# Altium schematic sheet Sheet1.SchDoc
size A; SheetNumber: 1; SheetTotal: 4
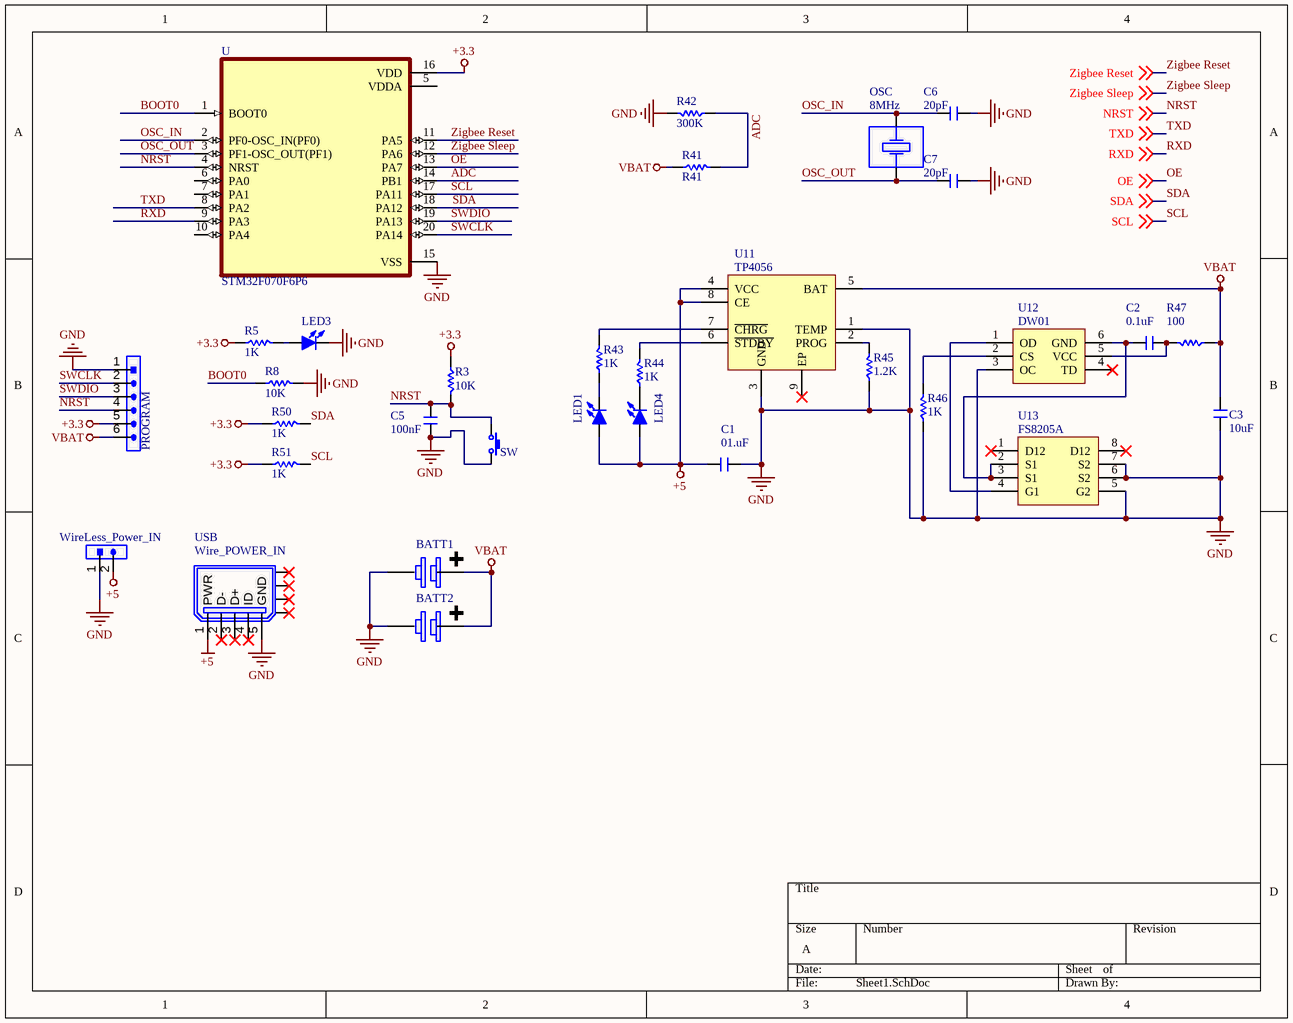
[diagram p0: Sheet1.SchDoc]

## Parts
BATT1  Battery 1850  [18650 SINGLE 2]  (value not drawn)
BATT2  Battery 1850  [18650 SINGLE 2]  (value not drawn)
C1  01.uF  [C 0402]
C2  0.1uF  [C 0402]
C3  10uF  [C 0603]
C5  100nF  [C 0805]
C6  20pF  [C 0805]
C7  20pF  [C 0805]
LED1  LED-SMD  [LED 0805R]  (value not drawn)
LED3  LED-SMD  [LED 0805R]  (value not drawn)
LED4  LED-SMD  [LED 0805G]  (value not drawn)
OSC  8MHz  [XTAL-HC49S-THD]
PROGRAM  HDR-1X6  [HDR-1X6]  (value not drawn)
R3  10K  [R 0805]
R5  1K  [R 0805]
R8  10K  [R 0805]
R41  R41  [R 0805]
R42  300K  [R 0805]
R43  1K  [R 0402]
R44  1K  [R 0402]
R45  1.2K  [R 0402]
R46  1K  [R 0402]
R47  100  [R 0402]
R50  1K  [R 0805]
R51  1K  [R 0805]
SW  3x6x5  [TSW SMD-3*6*2.5]  (value not drawn)
U  STM32F070F6P6  [SOP65P640X120-20N]
U11  TP4056  [SOP8_M-EP]
U12  DW01  [SOT23-6M]
U13  FS8205A  [SSOP8_L]
USB  Wire_POWER_IN  [USB-micro_B]
WireLess_Power_IN  HDR-1X2  [XH2.54-2P]  (value not drawn)

## Nets
+3.3: PROGRAM.5 R3.1 R5.1 R50.1 R51.1 U.16(VDD)
+5: C1.2 LED1.1(A) LED4.1(A) U11.4(VCC) U11.8(CE) USB.1(PWR) WireLess_Power_IN.2
GND: BATT1.2(-) BATT2.2(-) C1.1 C3.1 C5.1 C6.1 C7.1 LED3.2(K) PROGRAM.1 R8.2 R42.2 R45.1 R46.1 SW.2 U.15(VSS) U11.1(TEMP) U11.3(GND) U12.3(OC) U13.5(G2) U13.6(S2) U13.7(S2) USB.5(SHIELD) WireLess_Power_IN.1
VBAT: BATT1.1(+) BATT2.1(+) C3.2 PROGRAM.6 R41.1 R47.1 U11.5(BAT)
ADC: R41.2 R42.1 U.14(PB1)
BOOT0: R8.1 U.1(BOOT0)
NRST: C5.2 PROGRAM.4 R3.2 SW.1 U.4(NRST) ; off-sheet NRST
OE: U.13(PA7) ; off-sheet OE
OSC_IN: C6.2 OSC.2 U.2(PF0-OSC_IN(PF0))
OSC_OUT: C7.2 OSC.1 U.3(PF1-OSC_OUT(PF1))
RXD: U.9(PA3) ; off-sheet RXD
SCL: R51.2 U.17(PA11) ; off-sheet SCL
SDA: R50.2 U.18(PA12) ; off-sheet SDA
SWCLK: PROGRAM.2 U.20(PA14)
SWDIO: PROGRAM.3 U.19(PA13)
TXD: U.8(PA2) ; off-sheet TXD
Zigbee Reset: U.11(PA5) ; off-sheet Zigbee Reset
Zigbee Sleep: U.12(PA6) ; off-sheet Zigbee Sleep
NetC2_1: C2.1 U12.6(GND) U13.2(S1) U13.3(S1)
NetC2_2: C2.2 R47.2 U12.5(VCC)
NetLED1_2: LED1.2(K) R43.1
NetLED3_1: LED3.1(A) R5.2
NetLED4_2: LED4.2(K) R44.1
NetR43_2: R43.2 U11.7(~{CHRG})
NetR44_2: R44.2 U11.6(~{STDBY})
NetR45_2: R45.2 U11.2(PROG)
NetR46_2: R46.2 U12.2(CS)
NetU12_1: U12.1(OD) U13.4(G1)

Not connected (* = marked no-connect by the designer): U 5(VDDA) 6(PA0) 7(PA1) 10(PA4); U11 9(EP)*; U12 4(TD)*; U13 1(D12)* 8(D12)*; USB 2(D-)* 3(D+)* 4(ID)*

## Library data of the parts
C1-C3 C5-C7 = C: Non-polar patch capacitor; BOM名称: 无极性贴片电容; 版权归属: 源创客; 学习资源: www.ooocke.com
LED1 LED3 LED4 = LED-SMD: Patch LED; BOM名称: 贴片LED; 版权归属: 源创客; 学习资源: www.ooocke.com
OSC = XTAL-2: 2-Pin crystal; BOM名称: 2脚晶振; 版权归属: 源创客; 学习资源: www.ooocke.com
PROGRAM = Header 6: 6P Connector; BOM名称: 6P接插件; 版权归属: 源创客; 学习资源: www.ooocke.com
R3 R5 R8 R41-R47 R50 R51 = R: Chip resistor; 版权归属: 源创客; BOM名称: Chip resistor; 学习资源: www.ooocke.com
SW = TSW 3x6: 3x6 tact switch; BOM名称: 3x6轻触开关; 版权归属: 源创客; 学习资源: www.ooocke.com
U = STM32F070F6P6: ARMÂ® CortexÂ®-M0 STM32F0 Microcontroller IC 32-Bit 48MHz 32KB _32K x 8_ FLASH 20-TSSOP; MF: STMicroelectronics; SnapEDA_Link: https://www.snapeda.com/parts/STM32F070F6P6/STMicroelectronics/view-part/423630/?ref=snap; Value: *; Digi-Key_Part_Number: 497-17354-2-ND; Digi-Key_Purchase_URL: https://www.digikey.com/product-detail/en/stmicroelectronics/STM32F070F6P6TR/497-17354-2-ND/7313047?utm_source=snapeda&utm_medium=aggregator&utm_campaign=symbol; MP: STM32F070F6P6; Package: TSSOP-20 STMicroelectronics
U11 = TP4056: Lithium battery charge management; BOM名称: 锂电池充电管理; 版权归属: 源创客; 学习资源: www.ooocke.com
U12 = DW01: Lithium battery overcurrent protection IC; BOM名称: 过流保护IC; 版权归属: 源创客; 学习资源: www.ooocke.com
U13 = FS8205A: Dual N-Channel Enhancement Mode Power MOSFET
USB = USB-5P: Micro & Mini USB female; BOM名称: 微型USB母座; 版权归属: 源创客; 学习资源: www.ooocke.com
WireLess_Power_IN = Header 2: 2P Connector; BOM名称: 2P接插件; 版权归属: 源创客; 学习资源: www.ooocke.com